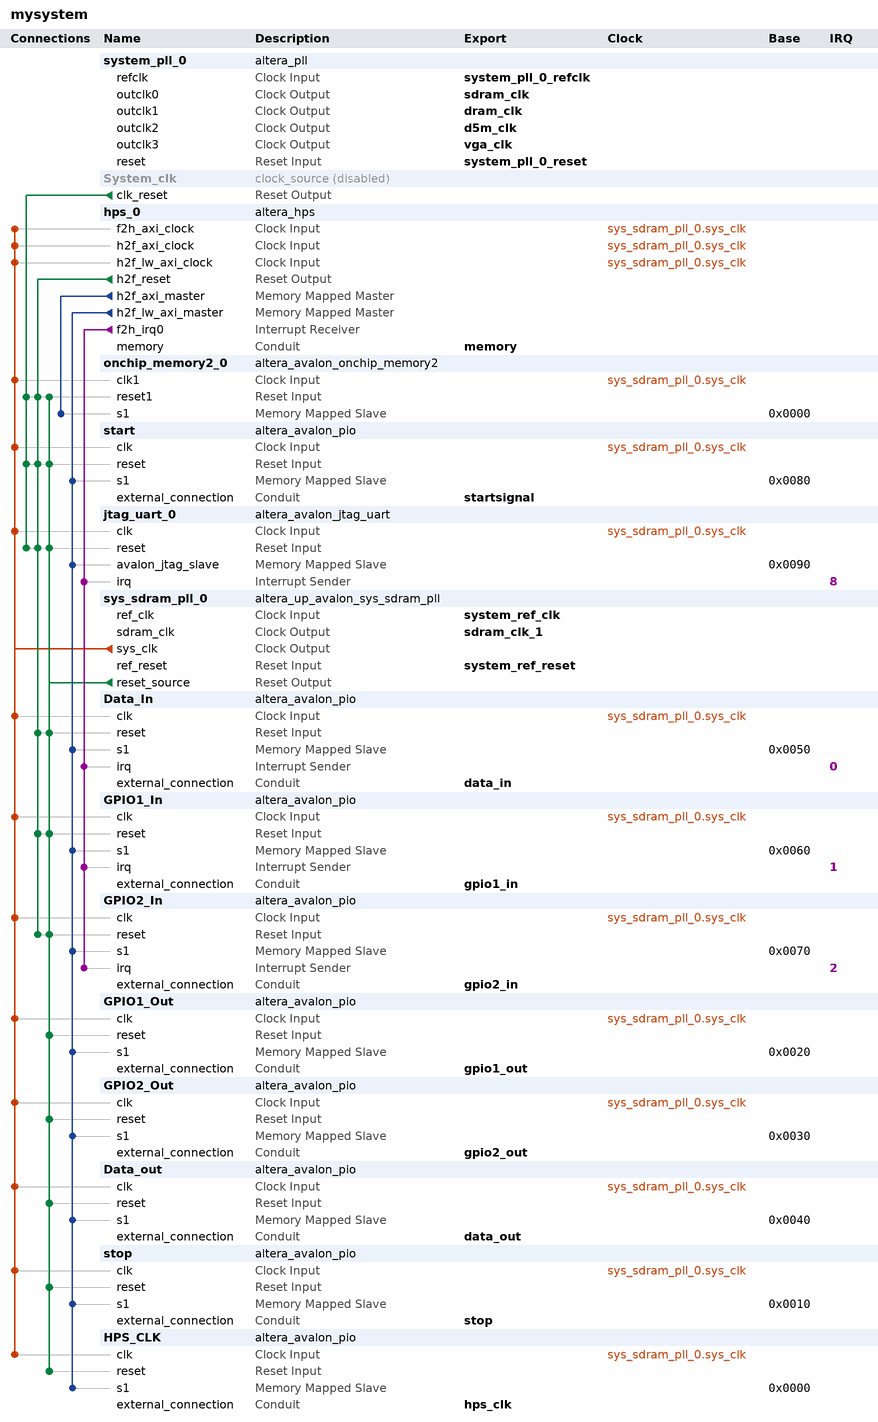
[diagram p0: system contents]
# Platform Designer (Qsys) system mysystem, Cyclone V 5CSEMA5F31C6
# Parameters at their usual value, and those the tool derives, are not listed.
package require -exact qsys 13.1
create_system mysystem
set_project_property DEVICE_FAMILY {Cyclone V}
set_project_property DEVICE 5CSEMA5F31C6

add_instance system_pll_0 altera_pll 13.1
set_instance_parameter_value system_pll_0 gui_device_speed_grade 2
set_instance_parameter_value system_pll_0 gui_pll_mode {Integer-N PLL}
set_instance_parameter_value system_pll_0 gui_reference_clock_frequency 50.0
set_instance_parameter_value system_pll_0 gui_operation_mode direct
set_instance_parameter_value system_pll_0 gui_use_locked false
set_instance_parameter_value system_pll_0 gui_number_of_clocks 4
set_instance_parameter_value system_pll_0 gui_output_clock_frequency0 100.0
set_instance_parameter_value system_pll_0 gui_output_clock_frequency1 100.0
set_instance_parameter_value system_pll_0 gui_ps_units1 degrees
set_instance_parameter_value system_pll_0 gui_phase_shift_deg1 -90.0
set_instance_parameter_value system_pll_0 gui_output_clock_frequency2 25.0
set_instance_parameter_value system_pll_0 gui_output_clock_frequency3 25.0

add_instance System_clk clock_source 13.1
set_instance_property System_clk ENABLED false
set_instance_parameter_value System_clk clockFrequency 50000000

add_instance hps_0 altera_hps 13.1
set_instance_parameter_value hps_0 MEM_VENDOR JEDEC
set_instance_parameter_value hps_0 MEM_CLK_FREQ_MAX 400.0
set_instance_parameter_value hps_0 MEM_ROW_ADDR_WIDTH 12
set_instance_parameter_value hps_0 MEM_COL_ADDR_WIDTH 8
set_instance_parameter_value hps_0 MEM_DQ_WIDTH 8
set_instance_parameter_value hps_0 MEM_BANKADDR_WIDTH 3
set_instance_parameter_value hps_0 MEM_DRV_STR RZQ/6
set_instance_parameter_value hps_0 MEM_RTT_NOM RZQ/6
set_instance_parameter_value hps_0 MEM_RTT_WR {Dynamic ODT off}
set_instance_parameter_value hps_0 MEM_WTCL 6
set_instance_parameter_value hps_0 MEM_TCL 7
set_instance_parameter_value hps_0 TIMING_TIS 175
set_instance_parameter_value hps_0 TIMING_TIH 250
set_instance_parameter_value hps_0 TIMING_TDS 50
set_instance_parameter_value hps_0 TIMING_TDH 125
set_instance_parameter_value hps_0 TIMING_TDQSQ 120
set_instance_parameter_value hps_0 TIMING_TDQSCK 400
set_instance_parameter_value hps_0 TIMING_TQSH 0.38
set_instance_parameter_value hps_0 MEM_TINIT_US 499
set_instance_parameter_value hps_0 MEM_TMRD_CK 3
set_instance_parameter_value hps_0 MEM_TRAS_NS 40.0
set_instance_parameter_value hps_0 MEM_TRCD_NS 15.0
set_instance_parameter_value hps_0 MEM_TRP_NS 15.0
set_instance_parameter_value hps_0 MEM_TREFI_US 7.0
set_instance_parameter_value hps_0 MEM_TRFC_NS 75.0
set_instance_parameter_value hps_0 MEM_TWTR 2
set_instance_parameter_value hps_0 MEM_TFAW_NS 37.5
set_instance_parameter_value hps_0 REF_CLK_FREQ 125.0
set_instance_parameter_value hps_0 DEFAULT_FAST_SIM_MODEL true
set_instance_parameter_value hps_0 TIMING_BOARD_MAX_CK_DELAY 0.6
set_instance_parameter_value hps_0 TIMING_BOARD_MAX_DQS_DELAY 0.6
set_instance_parameter_value hps_0 TIMING_BOARD_SKEW_CKDQS_DIMM_MIN -0.01
set_instance_parameter_value hps_0 TIMING_BOARD_SKEW_CKDQS_DIMM_MAX 0.01
set_instance_parameter_value hps_0 TIMING_BOARD_SKEW_WITHIN_DQS 0.02
set_instance_parameter_value hps_0 TIMING_BOARD_SKEW_BETWEEN_DQS 0.02
set_instance_parameter_value hps_0 TIMING_BOARD_DQ_TO_DQS_SKEW 0.0
set_instance_parameter_value hps_0 TIMING_BOARD_AC_SKEW 0.02
set_instance_parameter_value hps_0 TIMING_BOARD_AC_TO_CK_SKEW 0.0
set_instance_parameter_value hps_0 MEM_CLK_FREQ 300.0
set_instance_parameter_value hps_0 HPS_PROTOCOL DDR3
set_instance_parameter_value hps_0 STM_Enable false
set_instance_parameter_value hps_0 F2S_Width 2
set_instance_parameter_value hps_0 S2F_Width 3
set_instance_parameter_value hps_0 LWH2F_Enable true
set_instance_parameter_value hps_0 F2SCLK_DBGRST_Enable false
set_instance_parameter_value hps_0 F2SCLK_WARMRST_Enable false
set_instance_parameter_value hps_0 F2SCLK_COLDRST_Enable false
set_instance_parameter_value hps_0 F2SINTERRUPT_Enable true
set_instance_parameter_value hps_0 EMAC1_PinMuxing Unused
set_instance_parameter_value hps_0 EMAC1_Mode N/A
set_instance_parameter_value hps_0 QSPI_PinMuxing Unused
set_instance_parameter_value hps_0 QSPI_Mode N/A
set_instance_parameter_value hps_0 SDIO_PinMuxing Unused
set_instance_parameter_value hps_0 SDIO_Mode N/A
set_instance_parameter_value hps_0 USB1_PinMuxing Unused
set_instance_parameter_value hps_0 USB1_Mode N/A
set_instance_parameter_value hps_0 SPIM1_PinMuxing Unused
set_instance_parameter_value hps_0 SPIM1_Mode N/A
set_instance_parameter_value hps_0 UART0_PinMuxing Unused
set_instance_parameter_value hps_0 UART0_Mode N/A
set_instance_parameter_value hps_0 I2C0_PinMuxing Unused
set_instance_parameter_value hps_0 I2C0_Mode N/A
set_instance_parameter_value hps_0 I2C1_PinMuxing Unused
set_instance_parameter_value hps_0 I2C1_Mode N/A
set_instance_parameter_value hps_0 S2FCLK_USER1CLK_FREQ 100
set_instance_parameter_value hps_0 FPGA_PERIPHERAL_OUTPUT_CLOCK_FREQ_EMAC0_MD_CLK 100
set_instance_parameter_value hps_0 FPGA_PERIPHERAL_OUTPUT_CLOCK_FREQ_EMAC0_GTX_CLK 100
set_instance_parameter_value hps_0 FPGA_PERIPHERAL_OUTPUT_CLOCK_FREQ_EMAC1_MD_CLK 100
set_instance_parameter_value hps_0 FPGA_PERIPHERAL_OUTPUT_CLOCK_FREQ_EMAC1_GTX_CLK 100

add_instance onchip_memory2_0 altera_avalon_onchip_memory2 13.1
set_instance_parameter_value onchip_memory2_0 dataWidth 32
set_instance_parameter_value onchip_memory2_0 dualPort false
set_instance_parameter_value onchip_memory2_0 initMemContent true
set_instance_parameter_value onchip_memory2_0 initializationFileName onchip_mem.hex
set_instance_parameter_value onchip_memory2_0 memorySize 16384

add_instance start altera_avalon_pio 13.1
set_instance_parameter_value start direction Output
set_instance_parameter_value start width 1

add_instance jtag_uart_0 altera_avalon_jtag_uart 13.1
set_instance_parameter_value jtag_uart_0 simInteractiveOptions NO_INTERACTIVE_WINDOWS

add_instance sys_sdram_pll_0 altera_up_avalon_sys_sdram_pll 13.1
set_instance_parameter_value sys_sdram_pll_0 gui_refclk 50.0
set_instance_parameter_value sys_sdram_pll_0 gui_outclk 50.0
set_instance_parameter_value sys_sdram_pll_0 CV_boards DE1-SoC

add_instance Data_In altera_avalon_pio 13.1
set_instance_parameter_value Data_In bitClearingEdgeCapReg true
set_instance_parameter_value Data_In captureEdge true
set_instance_parameter_value Data_In direction Input
set_instance_parameter_value Data_In edgeType FALLING
set_instance_parameter_value Data_In generateIRQ true
set_instance_parameter_value Data_In irqType EDGE
set_instance_parameter_value Data_In simDoTestBenchWiring true
set_instance_parameter_value Data_In width 32

add_instance GPIO1_In altera_avalon_pio 13.1
set_instance_parameter_value GPIO1_In bitClearingEdgeCapReg true
set_instance_parameter_value GPIO1_In captureEdge true
set_instance_parameter_value GPIO1_In direction Input
set_instance_parameter_value GPIO1_In edgeType FALLING
set_instance_parameter_value GPIO1_In generateIRQ true
set_instance_parameter_value GPIO1_In irqType EDGE
set_instance_parameter_value GPIO1_In simDoTestBenchWiring true
set_instance_parameter_value GPIO1_In width 32

add_instance GPIO2_In altera_avalon_pio 13.1
set_instance_parameter_value GPIO2_In bitClearingEdgeCapReg true
set_instance_parameter_value GPIO2_In captureEdge true
set_instance_parameter_value GPIO2_In direction Input
set_instance_parameter_value GPIO2_In edgeType FALLING
set_instance_parameter_value GPIO2_In generateIRQ true
set_instance_parameter_value GPIO2_In irqType EDGE
set_instance_parameter_value GPIO2_In simDoTestBenchWiring true
set_instance_parameter_value GPIO2_In width 32

add_instance GPIO1_Out altera_avalon_pio 13.1
set_instance_parameter_value GPIO1_Out direction Output
set_instance_parameter_value GPIO1_Out width 32

add_instance GPIO2_Out altera_avalon_pio 13.1
set_instance_parameter_value GPIO2_Out direction Output
set_instance_parameter_value GPIO2_Out width 32

add_instance Data_out altera_avalon_pio 13.1
set_instance_parameter_value Data_out direction Output
set_instance_parameter_value Data_out width 32

add_instance stop altera_avalon_pio 13.1
set_instance_parameter_value stop bitClearingEdgeCapReg true
set_instance_parameter_value stop captureEdge true
set_instance_parameter_value stop direction Output
set_instance_parameter_value stop edgeType FALLING
set_instance_parameter_value stop generateIRQ true
set_instance_parameter_value stop irqType EDGE
set_instance_parameter_value stop simDoTestBenchWiring true
set_instance_parameter_value stop width 1

add_instance HPS_CLK altera_avalon_pio 13.1
set_instance_parameter_value HPS_CLK direction Output
set_instance_parameter_value HPS_CLK width 1

# connections
add_connection sys_sdram_pll_0.sys_clk Data_In.clk clock
add_connection sys_sdram_pll_0.sys_clk Data_out.clk clock
add_connection sys_sdram_pll_0.sys_clk GPIO1_In.clk clock
add_connection sys_sdram_pll_0.sys_clk GPIO1_Out.clk clock
add_connection sys_sdram_pll_0.sys_clk GPIO2_In.clk clock
add_connection sys_sdram_pll_0.sys_clk GPIO2_Out.clk clock
add_connection sys_sdram_pll_0.sys_clk hps_0.f2h_axi_clock clock
add_connection sys_sdram_pll_0.sys_clk hps_0.h2f_axi_clock clock
add_connection sys_sdram_pll_0.sys_clk hps_0.h2f_lw_axi_clock clock
add_connection sys_sdram_pll_0.sys_clk HPS_CLK.clk clock
add_connection sys_sdram_pll_0.sys_clk jtag_uart_0.clk clock
add_connection sys_sdram_pll_0.sys_clk onchip_memory2_0.clk1 clock
add_connection sys_sdram_pll_0.sys_clk start.clk clock
add_connection sys_sdram_pll_0.sys_clk stop.clk clock
add_connection hps_0.h2f_reset Data_In.reset reset
add_connection hps_0.h2f_reset GPIO1_In.reset reset
add_connection hps_0.h2f_reset GPIO2_In.reset reset
add_connection hps_0.h2f_reset jtag_uart_0.reset reset
add_connection hps_0.h2f_reset onchip_memory2_0.reset1 reset
add_connection hps_0.h2f_reset start.reset reset
add_connection sys_sdram_pll_0.reset_source Data_In.reset reset
add_connection sys_sdram_pll_0.reset_source Data_out.reset reset
add_connection sys_sdram_pll_0.reset_source GPIO1_In.reset reset
add_connection sys_sdram_pll_0.reset_source GPIO1_Out.reset reset
add_connection sys_sdram_pll_0.reset_source GPIO2_In.reset reset
add_connection sys_sdram_pll_0.reset_source GPIO2_Out.reset reset
add_connection sys_sdram_pll_0.reset_source HPS_CLK.reset reset
add_connection sys_sdram_pll_0.reset_source jtag_uart_0.reset reset
add_connection sys_sdram_pll_0.reset_source onchip_memory2_0.reset1 reset
add_connection sys_sdram_pll_0.reset_source start.reset reset
add_connection sys_sdram_pll_0.reset_source stop.reset reset
add_connection System_clk.clk_reset jtag_uart_0.reset reset
add_connection System_clk.clk_reset onchip_memory2_0.reset1 reset
add_connection System_clk.clk_reset start.reset reset
add_connection hps_0.h2f_axi_master onchip_memory2_0.s1 avalon
set_connection_parameter_value hps_0.h2f_axi_master/onchip_memory2_0.s1 baseAddress 0x0000
add_connection hps_0.h2f_lw_axi_master Data_In.s1 avalon
set_connection_parameter_value hps_0.h2f_lw_axi_master/Data_In.s1 baseAddress 0x0050
add_connection hps_0.h2f_lw_axi_master Data_out.s1 avalon
set_connection_parameter_value hps_0.h2f_lw_axi_master/Data_out.s1 baseAddress 0x0040
add_connection hps_0.h2f_lw_axi_master GPIO1_In.s1 avalon
set_connection_parameter_value hps_0.h2f_lw_axi_master/GPIO1_In.s1 baseAddress 0x0060
add_connection hps_0.h2f_lw_axi_master GPIO1_Out.s1 avalon
set_connection_parameter_value hps_0.h2f_lw_axi_master/GPIO1_Out.s1 baseAddress 0x0020
add_connection hps_0.h2f_lw_axi_master GPIO2_In.s1 avalon
set_connection_parameter_value hps_0.h2f_lw_axi_master/GPIO2_In.s1 baseAddress 0x0070
add_connection hps_0.h2f_lw_axi_master GPIO2_Out.s1 avalon
set_connection_parameter_value hps_0.h2f_lw_axi_master/GPIO2_Out.s1 baseAddress 0x0030
add_connection hps_0.h2f_lw_axi_master HPS_CLK.s1 avalon
set_connection_parameter_value hps_0.h2f_lw_axi_master/HPS_CLK.s1 baseAddress 0x0000
add_connection hps_0.h2f_lw_axi_master jtag_uart_0.avalon_jtag_slave avalon
set_connection_parameter_value hps_0.h2f_lw_axi_master/jtag_uart_0.avalon_jtag_slave baseAddress 0x0090
add_connection hps_0.h2f_lw_axi_master start.s1 avalon
set_connection_parameter_value hps_0.h2f_lw_axi_master/start.s1 baseAddress 0x0080
add_connection hps_0.h2f_lw_axi_master stop.s1 avalon
set_connection_parameter_value hps_0.h2f_lw_axi_master/stop.s1 baseAddress 0x0010
add_connection hps_0.f2h_irq0 Data_In.irq interrupt
set_connection_parameter_value hps_0.f2h_irq0/Data_In.irq irqNumber 0
add_connection hps_0.f2h_irq0 GPIO1_In.irq interrupt
set_connection_parameter_value hps_0.f2h_irq0/GPIO1_In.irq irqNumber 1
add_connection hps_0.f2h_irq0 GPIO2_In.irq interrupt
set_connection_parameter_value hps_0.f2h_irq0/GPIO2_In.irq irqNumber 2
add_connection hps_0.f2h_irq0 jtag_uart_0.irq interrupt
set_connection_parameter_value hps_0.f2h_irq0/jtag_uart_0.irq irqNumber 8

# exported interfaces
add_interface sdram_clk clock source
set_interface_property sdram_clk EXPORT_OF system_pll_0.outclk0
add_interface dram_clk clock source
set_interface_property dram_clk EXPORT_OF system_pll_0.outclk1
add_interface d5m_clk clock source
set_interface_property d5m_clk EXPORT_OF system_pll_0.outclk2
add_interface vga_clk clock source
set_interface_property vga_clk EXPORT_OF system_pll_0.outclk3
add_interface system_pll_0_refclk clock sink
set_interface_property system_pll_0_refclk EXPORT_OF system_pll_0.refclk
add_interface system_pll_0_reset reset sink
set_interface_property system_pll_0_reset EXPORT_OF system_pll_0.reset
add_interface memory conduit end
set_interface_property memory EXPORT_OF hps_0.memory
add_interface startsignal conduit end
set_interface_property startsignal EXPORT_OF start.external_connection
add_interface system_ref_clk clock sink
set_interface_property system_ref_clk EXPORT_OF sys_sdram_pll_0.ref_clk
add_interface sdram_clk_1 clock source
set_interface_property sdram_clk_1 EXPORT_OF sys_sdram_pll_0.sdram_clk
add_interface system_ref_reset reset sink
set_interface_property system_ref_reset EXPORT_OF sys_sdram_pll_0.ref_reset
add_interface data_in conduit end
set_interface_property data_in EXPORT_OF Data_In.external_connection
add_interface gpio1_in conduit end
set_interface_property gpio1_in EXPORT_OF GPIO1_In.external_connection
add_interface gpio2_in conduit end
set_interface_property gpio2_in EXPORT_OF GPIO2_In.external_connection
add_interface gpio1_out conduit end
set_interface_property gpio1_out EXPORT_OF GPIO1_Out.external_connection
add_interface data_out conduit end
set_interface_property data_out EXPORT_OF Data_out.external_connection
add_interface stop conduit end
set_interface_property stop EXPORT_OF stop.external_connection
add_interface gpio2_out conduit end
set_interface_property gpio2_out EXPORT_OF GPIO2_Out.external_connection
add_interface hps_clk conduit end
set_interface_property hps_clk EXPORT_OF HPS_CLK.external_connection

set_interconnect_requirement {$system} qsys_mm.clockCrossingAdapter HANDSHAKE
set_interconnect_requirement {$system} qsys_mm.maxAdditionalLatency 1
set_interconnect_requirement {$system} qsys_mm.insertDefaultSlave false

save_system mysystem.qsys
